# EasyEDA Pro project camara-detection.eprj, schematic 1_p0_core
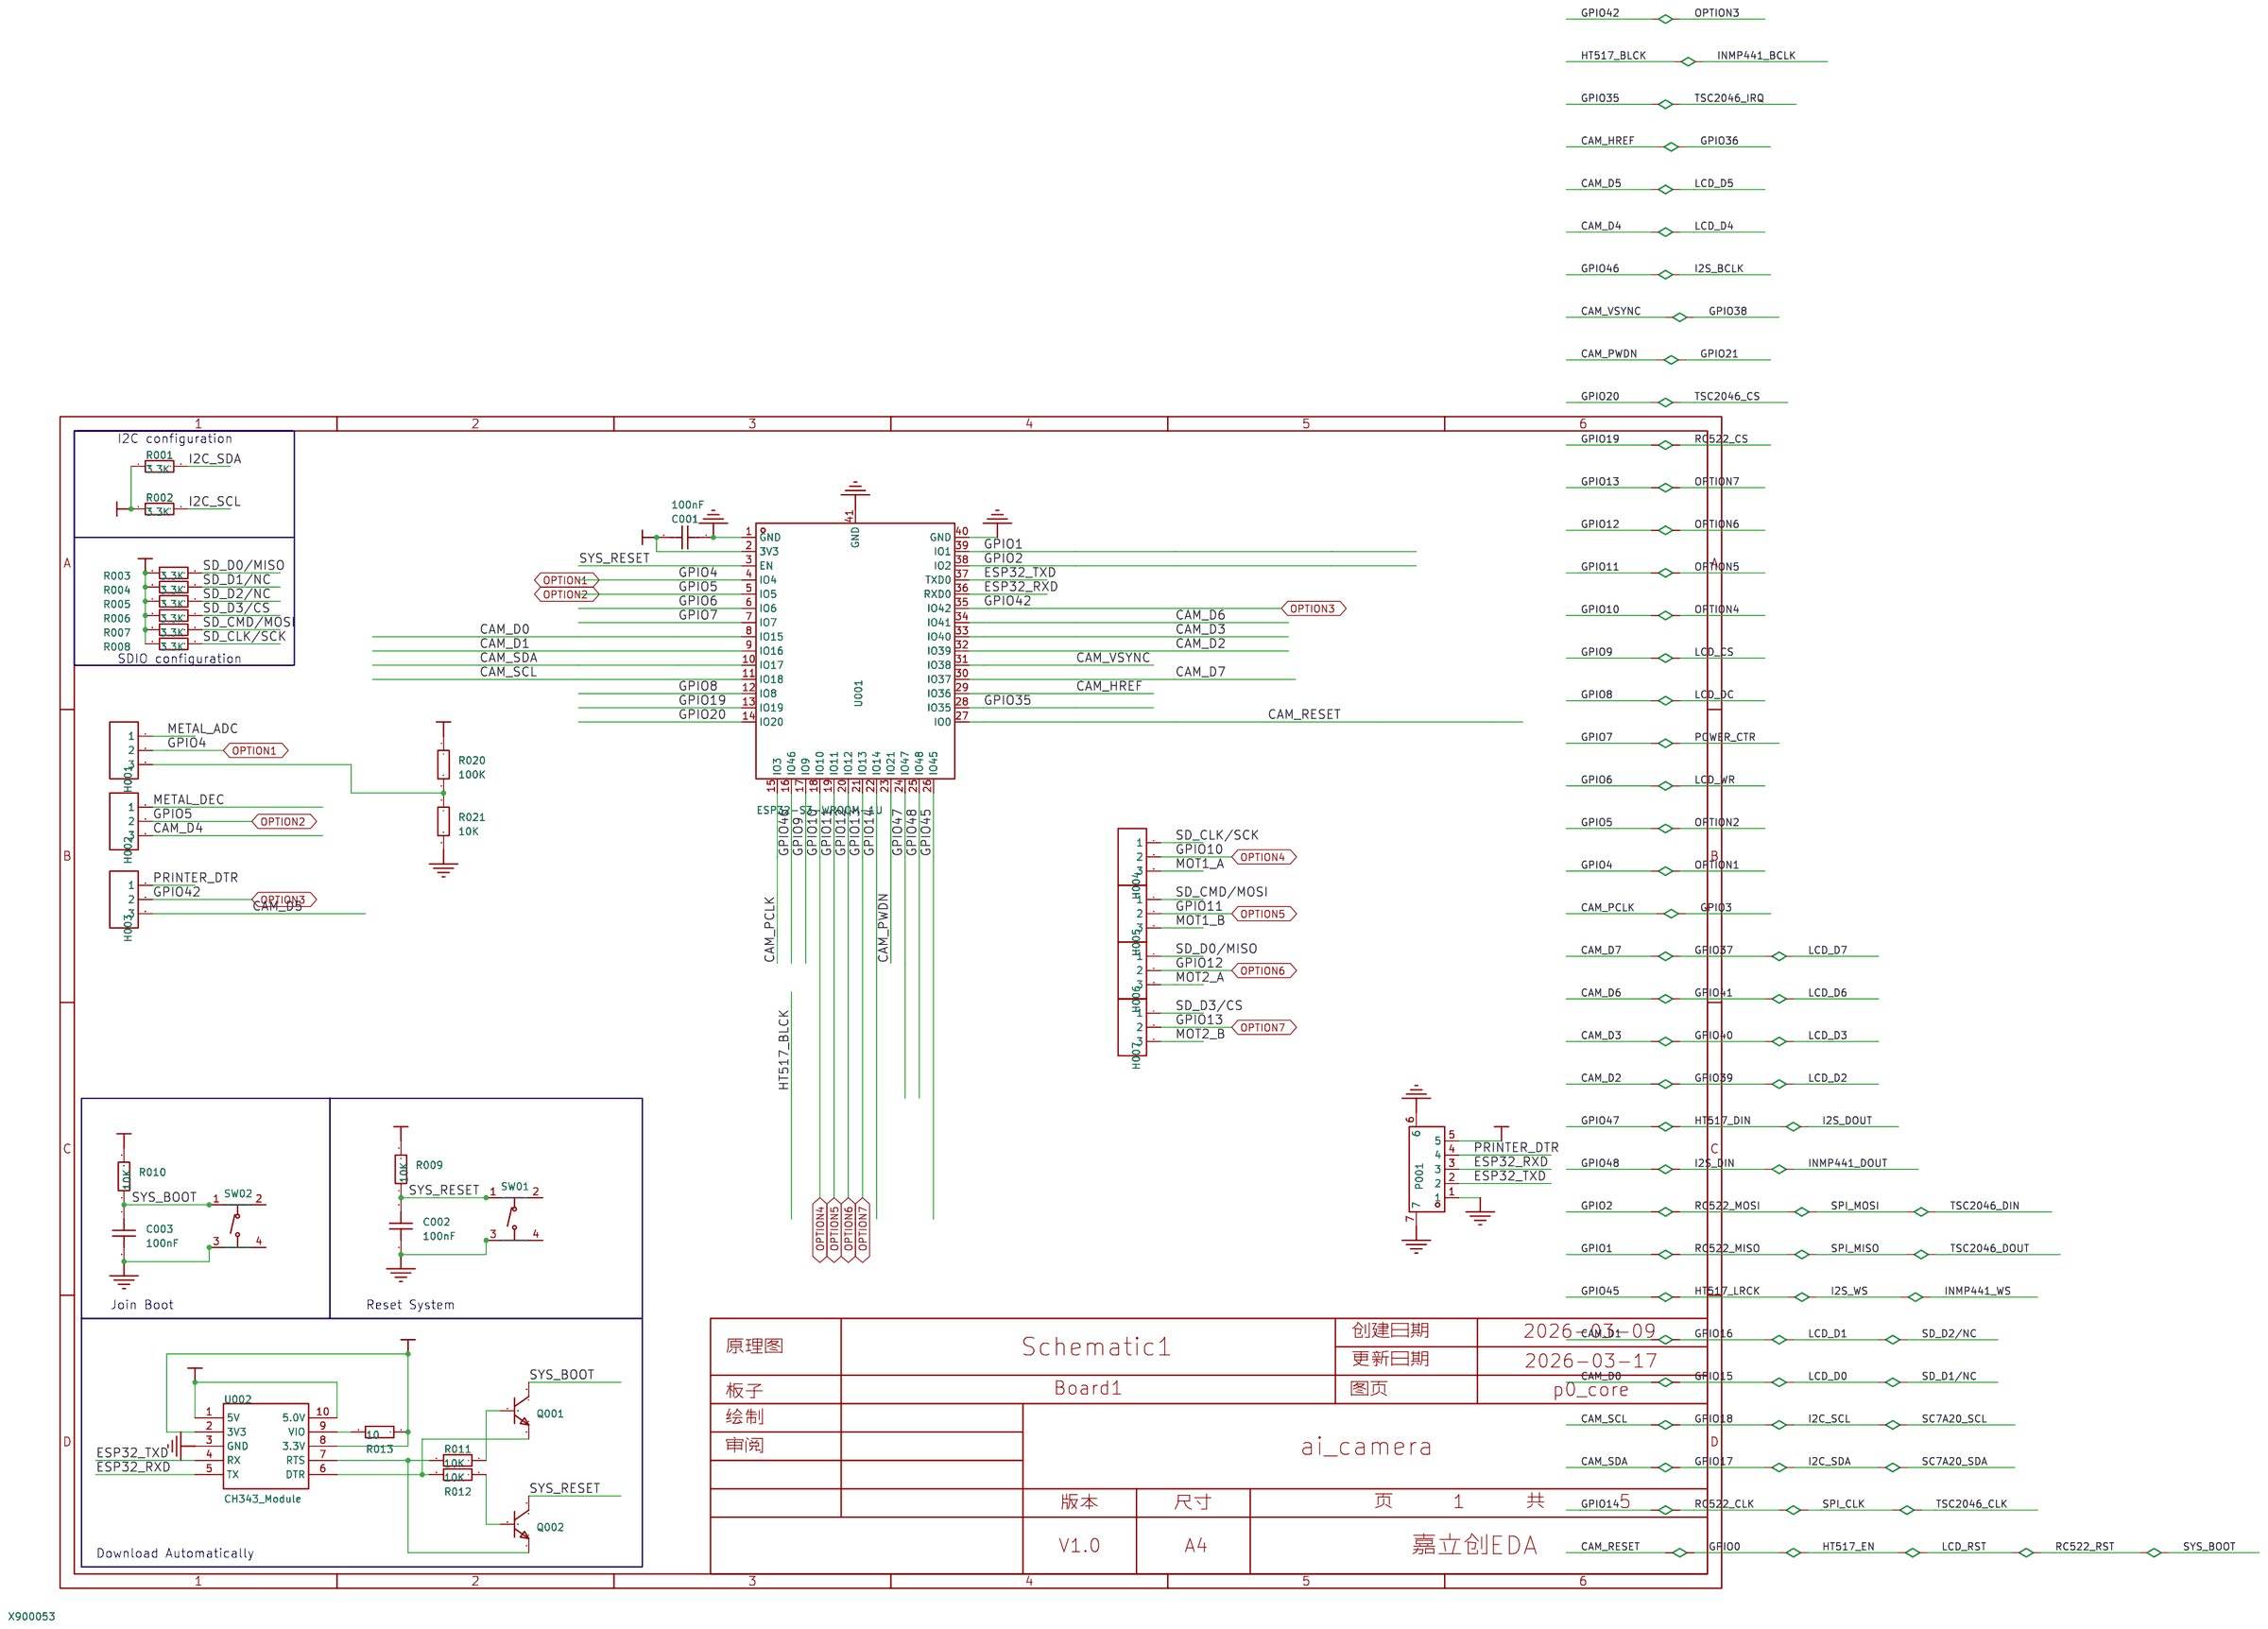
[diagram p0: schematic sheet]

## Parts
C001  100nF  [C0603]
C002  100nF  [C0603]
C003  100nF  [C0603]
H001  2.54-1*3P针  [HDR-TH_3P-P2.54-V-M-1]
H002  2.54-1*3P针  [HDR-TH_3P-P2.54-V-M-1]
H003  2.54-1*3P针  [HDR-TH_3P-P2.54-V-M-1]
H004  2.54-1*3P针  [HDR-TH_3P-P2.54-V-M-1]
H005  2.54-1*3P针  [HDR-TH_3P-P2.54-V-M-1]
H006  2.54-1*3P针  [HDR-TH_3P-P2.54-V-M-1]
H007  2.54-1*3P针  [HDR-TH_3P-P2.54-V-M-1]
P001  HX20007-5AWB  [CONN-SMD_5P-P2.00_HX20007-5AWB]
Q001  SS8050  [SOT-23-3_L2.9-W1.3-P1.90-LS2.4-BR]
Q002  SS8050  [SOT-23-3_L2.9-W1.3-P1.90-LS2.4-BR]
R001  10K  [R0603]
R002  10K  [R0603]
R003  10K  [R0603]
R004  10K  [R0603]
R005  10K  [R0603]
R006  10K  [R0603]
R007  10K  [R0603]
R008  10K  [R0603]
R009  10K  [R0603]
R010  10K  [R0603]
R011  10K  [R0603]
R012  10K  [R0603]
R013  10K  [R0603]
R020  10K  [R0603]
R021  10K  [R0603]
SW01  TS-1187A-B-A-B  [SW-SMD_4P-L5.1-W5.1-P3.70-LS6.5-TL-2]
SW02  TS-1187A-B-A-B  [SW-SMD_4P-L5.1-W5.1-P3.70-LS6.5-TL-2]
U001  ESP32-S3-WROOM-1U
U002  CH343_Module

## Library data of the parts
C001 C002 C003 = CAP_0603: Supplier Footprint: 0603
H001 H002 H003 H004 H005 H006 H007 = 2.54-1*3P针: LCSC Part Name: 2.54mm 1x3P 直插 方针; Supplier Part: C49257; Manufacturer: BOOMELE(博穆精密); Supplier Footprint: 插件,P=2.54mm; JLCPCB Part Class: Extended Part; Datasheet: https://atta.szlcsc.com/upload/public/pdf/source/20151109/1457707570948.pdf; Supplier: LCSC; Pitch: 2.54mm; Number of Pins: 3; Number of Rows: 1; Pin Structure: 1x3P; Mounting Type: 直插; Circluar Pins/Square Pins: 方针; Current Rating (Max): 3A; Operating Temperature Range: -40℃~+105℃; Color: 黑色
P001 = HX20007-5AWB: LCSC Part Name: 母座 卧贴 2.0mm 5Pin位 母座; Supplier Part: C442225; Manufacturer: HX(红星); Supplier Footprint: SMD,P=2mm; JLCPCB Part Class: Extended Part; Datasheet: https://atta.szlcsc.com/upload/public/pdf/source/20191028/C442225_DDD2455535F7EA1D3D205E5EFB10C902.pdf; Supplier: LCSC; Reference Series: PH; Pitch: 2mm; Pins Structure: 1x5P; Number of Rows: 1; Number of PINs Per Row: 5; Gender: 公型插针; Mounting Style: 卧贴
Q001 Q002 = SS8050: LCSC Part Name: SS8050 Y1 200-350 Y1 200-350; Supplier Part: C2150; Manufacturer: CJ（江苏长电/长晶）; Supplier Footprint: SOT-23(SOT-23-3); JLCPCB Part Class: Basic Part; Datasheet: https://atta.szlcsc.com/upload/public/pdf/source/20140809/1457707209319.pdf; Supplier: LCSC; Transistor Type: NPN; Collector-Emitter Breakdown Voltage (Vceo): 25V; Collector Current (Ic): 1.5A; Power Dissipation (Pd): 300mW; Collector-Emitter Saturation Voltage (VCE(sat)@Ic,Ib): 500mV@800mA,80mA; DC Current Gain (hFE@Ic,Vce): 200@100mA,1V; Transition Frequency (fT): 100MHz; Operating Temperature: +150℃@(Tj)
R001 R002 R003 R004 R005 R006 R007 R008 R009 R010 R011 R012 R013 R020 R021 = Res_0603: Supplier Footprint: 0603
SW01 SW02 = TS-1187A-B-A-B: LCSC Part Name: 5.1*5.1*1.5 防水金属头160gf; Supplier Part: C318884; Manufacturer: XKB Connectivity(中国星坤); Supplier Footprint: SMD; JLCPCB Part Class: Basic Part; Datasheet: https://atta.szlcsc.com/upload/public/pdf/source/20200227/C318884_1F20165719E1C4CAA3E10C4C359C6E26.pdf; Supplier: LCSC; Contact Current: 50mA; Voltage Rating (DC): 12V; Insulation Resistance: 100mΩ; Circuit: 单刀单掷; Mounting Style: 立贴; Actuator Style: 圆形按钮; Actuator/Cap Color: 金色; With Lamp: 无; Operating Force: 160gf; Mechanical Life: 100000; Operating Temperature: -30℃~+85℃; Switch Length: 5.1mm; Switch Width: 5.1mm; Switch Height: 1.5mm; Strike Gundam: 否
U001 = ESP32-S3-WROOM-1U
U002 = CH343_Module

## Nets
+3V3: C001.2 R001.1 R002.1 R003.1 R004.1 R005.1 R006.1 R007.1 R008.1 R009.2 R010.2 U001.2(3V3)
+12V: P001.5 R020.1
GND: C001.1 C002.2 C003.2 P001.1 P001.6 P001.7 R021.2 SW01.3(C) SW01.4(D) SW02.3(C) SW02.4(D) U001.1(GND) U001.40(GND) U001.41(GND) U002.3(GND)
CAM_D0: R004.2 U001.8(IO15)
CAM_D1: R005.2 U001.9(IO16)
CAM_D2: U001.32(IO39)
CAM_D3: U001.33(IO40)
CAM_D4: H002.3
CAM_D5: H003.3
CAM_D6: U001.34(IO41)
CAM_D7: U001.30(IO37)
CAM_HREF: U001.29(IO36)
CAM_PCLK: U001.15(IO3)
CAM_PWDN: U001.23(IO21)
CAM_RESET: C003.1 Q001.3(C) R010.1 SW02.1(A) SW02.2(B) U001.27(IO0)
CAM_SCL: R002.2 U001.11(IO18)
CAM_SDA: R001.2 U001.10(IO17)
CAM_VSYNC: U001.31(IO38)
CH343_3V3: R013.1 U002.2(3V3) U002.8(3.3V)
ESP32_RXD: P001.3 U001.36(RXD0) U002.5(TX)
ESP32_TXD: P001.2 U001.37(TXD0) U002.4(RX)
GPIO1: U001.39(IO1)
GPIO2: U001.38(IO2)
GPIO4: H001.2 U001.4(IO4)
GPIO5: H002.2 U001.5(IO5)
GPIO6: U001.6(IO6)
GPIO7: U001.7(IO7)
GPIO8: U001.12(IO8)
GPIO9: U001.17(IO9)
GPIO10: H004.2 U001.18(IO10)
GPIO11: H005.2 U001.19(IO11)
GPIO12: H006.2 U001.20(IO12)
GPIO13: H007.2 U001.21(IO13)
GPIO14: U001.22(IO14)
GPIO19: U001.13(IO19)
GPIO20: U001.14(IO20)
GPIO35: U001.28(IO35)
GPIO42: H003.2 U001.35(IO42)
GPIO45: U001.26(IO45)
GPIO46: U001.16(IO46)
GPIO47: U001.24(IO47)
GPIO48: U001.25(IO48)
METAL_ADC: H001.1
METAL_DEC: H002.1
MOT1_A: H004.3
MOT1_B: H005.3
MOT2_A: H006.3
MOT2_B: H007.3
PRINTER_DTR: H003.1 P001.4
SD_CLK/SCK: H004.1 R008.2
SD_CMD/MOSI: H005.1 R007.2
SD_D0/MISO: H006.1 R003.2
SD_D3/CS: H007.1 R006.2
SYS_RESET: C002.1 Q002.3(C) R009.1 SW01.1(A) SW01.2(B) U001.3(EN)
VUSB: U002.1(5V) U002.10(5.0V)
Net-(H001-3): H001.3 R020.2 R021.1
Net-(Q001-1): Q001.1(B) R011.1
Net-(Q001-2): Q001.2(E) R012.2 U002.6(DTR)
Net-(Q002-1): Q002.1(B) R012.1
Net-(Q002-2): Q002.2(E) R011.2 U002.7(RTS)
Net-(R013-2): R013.2 U002.9(VIO)

## Notes on the sheet
- I2C configuration
- SDIO configuration
- Join Boot
- Reset System
- Download Automatically
